# EAGLE design CAN-D Helper Rev1 (EAGLE 9.3.1)
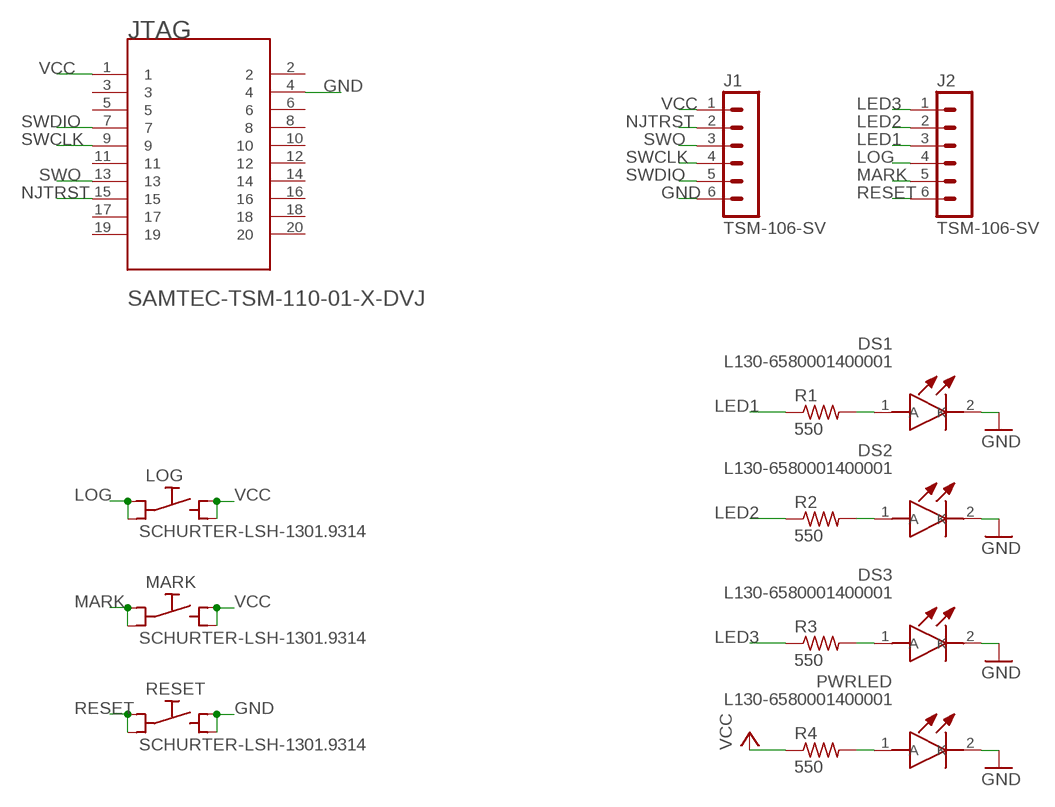
[diagram p0: schematic, sheet 1]

## Parts
DS1  L130-6580001400001  [L130-6580001400001]
DS2  L130-6580001400001  [L130-6580001400001]
DS3  L130-6580001400001  [L130-6580001400001]
J1  TSM-106-SV  [TSM-106-SV]
J2  TSM-106-SV  [TSM-106-SV]
JTAG  SAMTEC-TSM-110-01-X-DVJ  [SAMTEC-TSM-110-01-X-DV]
LOG  SCHURTER-LSH-1301.9314  [LSH]
MARK  SCHURTER-LSH-1301.9314  [LSH]
PWRLED  L130-6580001400001  [L130-6580001400001]
R1  550  R-US_R0603  [R0603]
R2  550  R-US_R0603  [R0603]
R3  550  R-US_R0603  [R0603]
R4  550  R-US_R0603  [R0603]
RESET  SCHURTER-LSH-1301.9314  [LSH]

## Nets
GND: DS1.2(K) DS2.2(K) DS3.2(K) J1.6 JTAG.4 PWRLED.2(K) RESET.NO1(NO) RESET.NO2(NO)
LED1: J2.3 R1.1
LED2: J2.2 R2.1
LED3: J2.1 R3.1
LOG: J2.4 LOG.C1(C) LOG.C2(C)
MARK: J2.5 MARK.C1(C) MARK.C2(C)
N$7: DS1.1(A) R1.2
N$8: DS2.1(A) R2.2
N$9: DS3.1(A) R3.2
N$10: PWRLED.1(A) R4.2
NJTRST: J1.2 JTAG.15
RESET: J2.6 RESET.C1(C) RESET.C2(C)
SWCLK: J1.4 JTAG.9
SWDIO: J1.5 JTAG.7
SWO: J1.3 JTAG.13
VCC: J1.1 JTAG.1 LOG.NO1(NO) LOG.NO2(NO) MARK.NO1(NO) MARK.NO2(NO) R4.1
Unconnected: JTAG.2 JTAG.3 JTAG.5 JTAG.6 JTAG.8 JTAG.10 JTAG.11 JTAG.12 JTAG.14 JTAG.16 JTAG.17 JTAG.18 JTAG.19 JTAG.20

## Library data of the parts
DS1-DS3 PWRLED = L130-6580001400001:L130-6580001400001: Lumileds L130-6580001400001, LUXEON 3014 Series White LED, 6500K, 3014, Rectangle Lens SMD Package Source: Datasheet <http://www.lumileds.com/uploads/459/DS208-pdf>; ALLIED_NUMBER: 70522463; ALLIED_PRICE-STOCK: http://www.alliedelec.com/lumileds-l130-6580001400001/70522463/; DESCRIPTION: Lumileds L130-6580001400001, LUXEON 3014 Series White LED, 6500K, 3014, Rectangle Lens SMD Package; HEIGHT: mm; MANUFACTURER_NAME: Lumileds; MANUFACTURER_PART_NUMBER: L130-6580001400001; MOUSER_PART_NUMBER: 997-L130-65800014001; MOUSER_PRICE-STOCK: https://www.mouser.com/Search/Refine.aspx?Keyword=997-L130-65800014001; RS_PART_NUMBER: 1709867; RS_PRICE-STOCK: http://uk.rs-online.com/web/p/products/1709867
J1 J2 = con-samtec:TSM-106-SV: SMD PIN HEADER
JTAG = SAMTEC-TSM-110-01-X-DV:SAMTEC-TSM-110-01-X-DV; DESCRIPTION: Conn Unshrouded Header HDR 20 POS 2.54mm Solder ST SMD T/R; DIGI-KEY_PART_NUMBER: SAM14887CT-ND; DIGI-KEY_PURCHASE_URL: https://www.digikey.ca/product-detail/en/samtec-inc/TSM-110-01-T-DV-TR/SAM14887CT-ND/9595179?utm_source=snapeda&utm_medium=aggregator&utm_campaign=symbol; MF: Samtec Inc.; MP: TSM-110-01-T-DV-TR; PACKAGE: None
LOG MARK RESET = schurter_switches_LSH_SMS:SCHURTER-LSH-*: Schurter LSH Printmount Switches, Gullwing Leads Momentary Action: Normally Open (NO) 6.0 x 6.0 mm Body Dim. Actuator Diam. mm / Overall Height mm / Schurter # -------------------------------------------------------------- 3.40 / 4.30 / 1301.9314.xx 3.40 / 4.30 / 1301.9315.xx 3.20 / 7.00 / 1301.9316.xx 3.30 / 7.30 / 1301.9317.xx 3.10 / 8.00 / 1301.9319.xx 3.00 / 12.5 / 1301.9320.xx xx: denotes packaging, see Schurter data sheets Author: Dipl.-Ing. FH Rainer Bayer Hochschule Heilbronn HHN: rainer.bayer@hs-heilbronn.de | http://mitarbeiter.hs-heilbronn.de/~rbayer/ Ingenieurbüro ing-rb: mail@ing-rb.de | http://www.ing-rb.de/
R1-R4 = rcl:R-US_: RESISTOR, American symbol; SPICEPREFIX: R

## Board
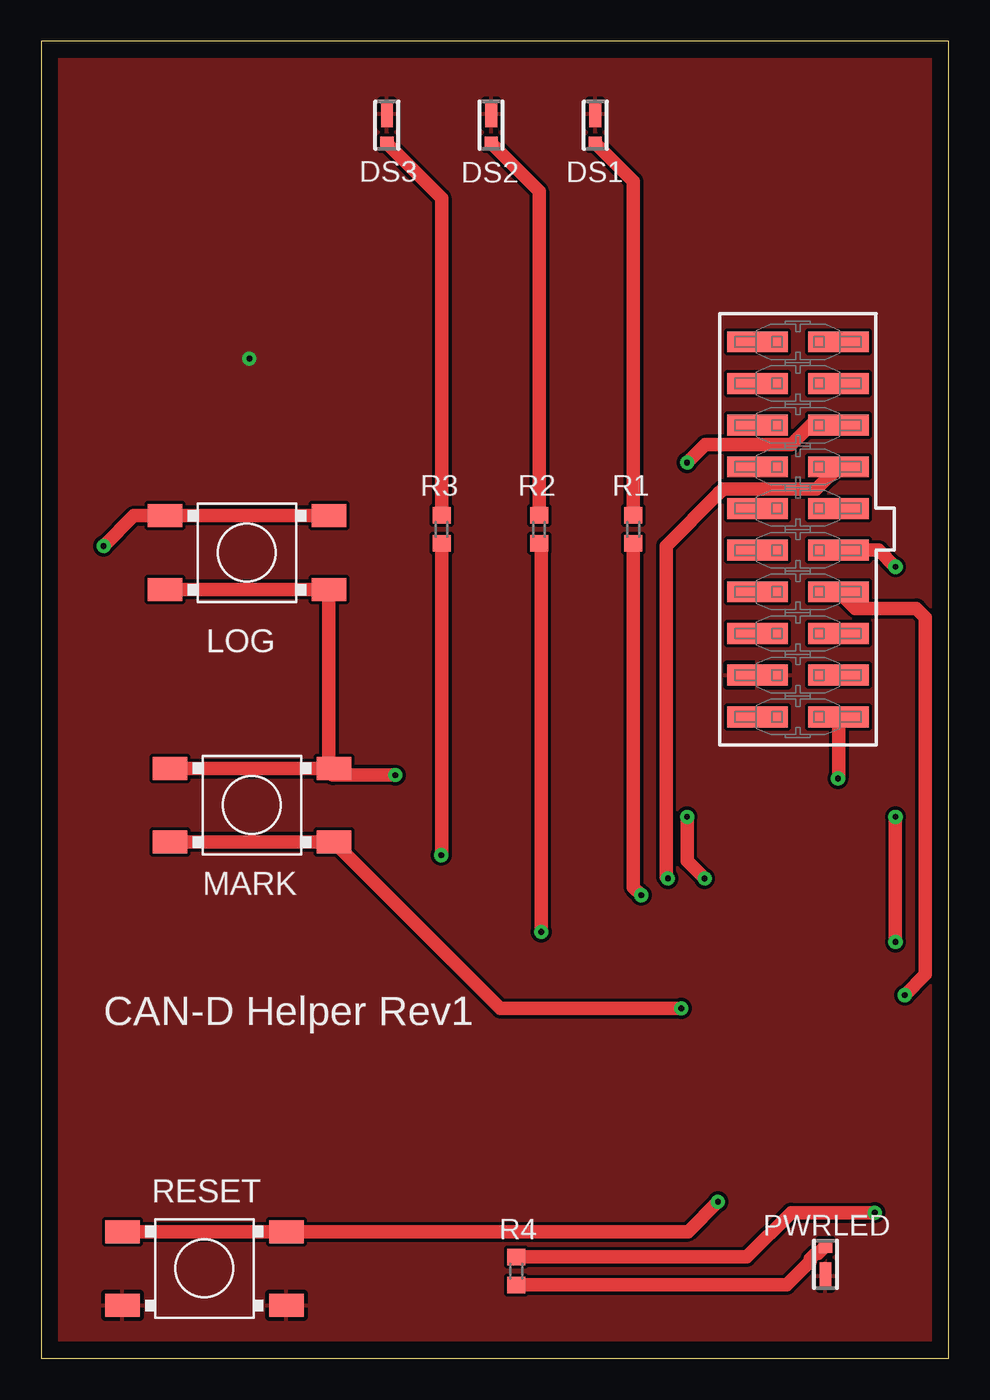
[diagram p1: board, top side]
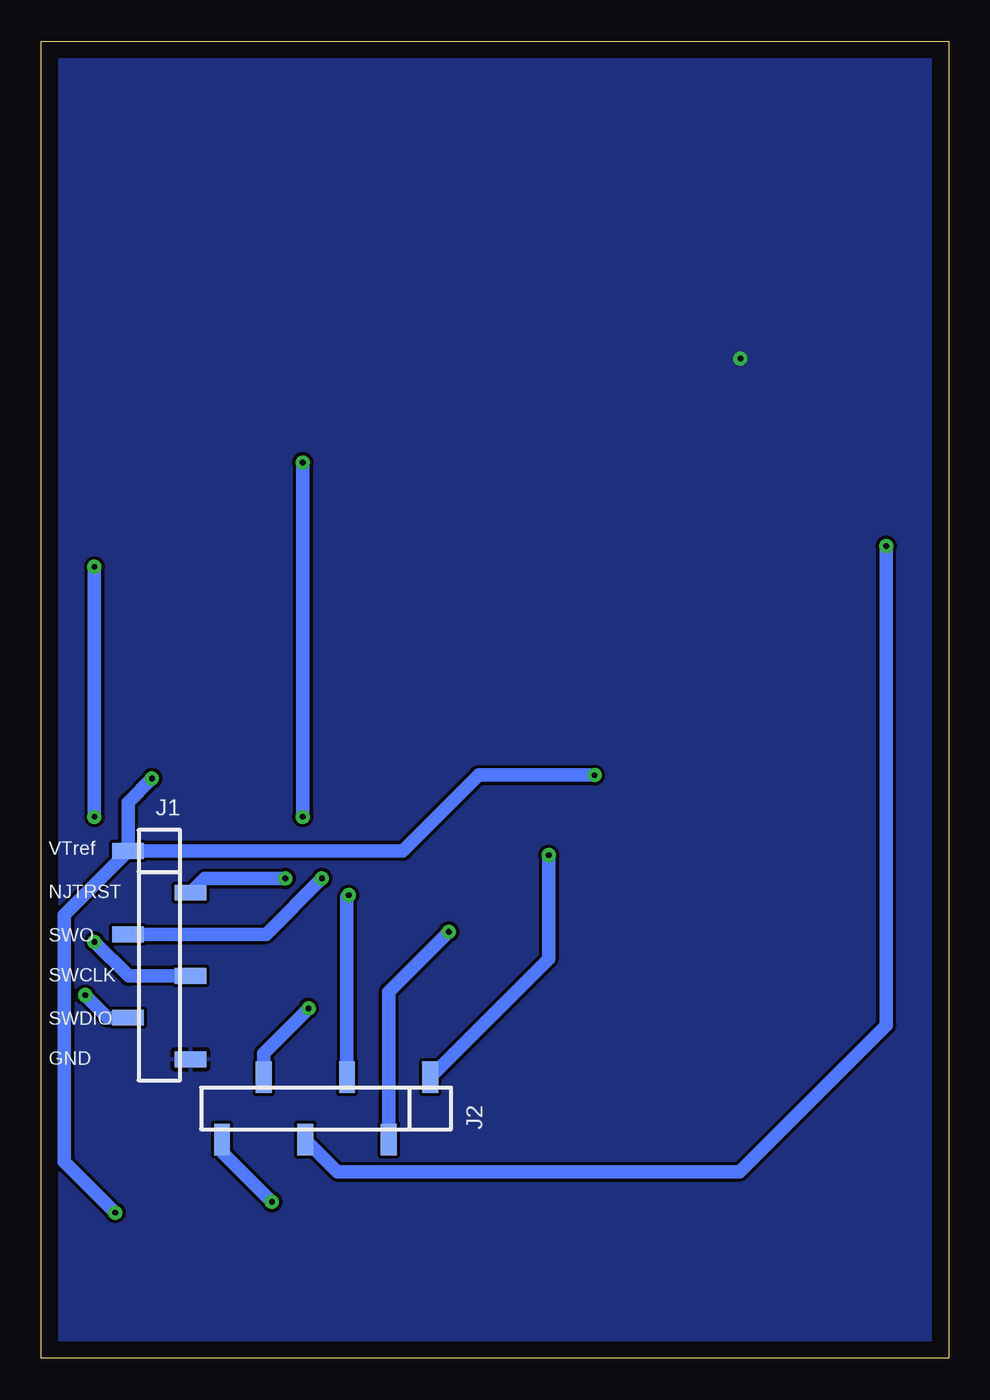
[diagram p2: board, bottom side, seen from below]

Size 55.32 x 80.31 mm. Coordinates in mm from the lower left corner, seen from the top.
Outline: 0,0 55.32,0 55.32,80.31 0,80.31 0,0
Copper layers (1*16): Top 0.035mm / dielectric 1.5mm / Bottom 0.035mm
Design rules "mine": minimum track width 11mil, minimum drill 0.3mm, track to track 8mil, track to pad 6mil, pad to pad 6mil, via to via 6mil, smd to smd 6mil, copper to edge 40mil, drill to drill 6mil, minimum pad ring 12mil, minimum via ring 10mil, stop-mask expansion 4mil, vias tented up to drill 15mil, thermal gap 10mil

### Footprints (pad centres in the part's own frame; a part is rotated, then mirrored left to right if it is on the bottom)
L130-6580001400001 = smd 0.8 x 0.8: 1 -1.11,0 | smd 1.61 x 0.72: 2 0.695,0
TSM-106-SV = smd 0.965 x 1.93: 1 6.35,1.905; 2 3.81,-1.905; 3 1.27,1.905; 4 -1.27,-1.905; 5 -3.81,1.905; 6 -6.35,-1.905
SAMTEC-TSM-110-01-X-DV = smd 1.27 x 3.68: 1 -11.43,-2.476; 2 -11.43,2.476; 3 -8.89,-2.476; 4 -8.89,2.476; 5 -6.35,-2.476; 6 -6.35,2.476; 7 -3.81,-2.476; 8 -3.81,2.476; 9 -1.27,-2.476; 10 -1.27,2.476; 11 1.27,-2.476; 12 1.27,2.476; 13 3.81,-2.476; 14 3.81,2.476; 15 6.35,-2.476; 16 6.35,2.476; 17 8.89,-2.476; 18 8.89,2.476; 19 11.43,-2.476; 20 11.43,2.476
LSH = smd 2.1 x 1.4: C1 -5,-2.25; C2 5,-2.25; NO1 -5,2.25; NO2 5,2.25
R0603 = smd 1 x 1.1: 1 -0.85,0; 2 0.85,0

### Placement (x,y rotation side)
DS1  33.78,75.18 90 top
DS2  27.43,75.18 90 top
DS3  21.08,75.18 90 top
J1  48.11,24.59 90 bottom
J2  37.95,15.24 0 bottom
JTAG  46.13,50.55 90 top
LOG  12.55,49.12 180 top
MARK  12.85,33.73 0 top
PWRLED  47.8,5.74 270 top
R1  36.09,50.55 90 top
R2  30.35,50.55 90 top
R3  24.41,50.55 90 top
R4  28.96,5.33 270 top
RESET  9.96,5.49 180 top

### Tracks (layer width: path | path; a pad name or v marks a point on that pad's centre or on a via)
GND  (via drill 0.35)
  other vias: 12.7,60.96
  pour Top: -2.54,82.55 58.42,82.55 58.42,-2.54 -2.54,-2.54
  pour Bottom: -2.54,82.55 58.42,82.55 58.42,-2.54 -2.54,-2.54
LED1  (via drill 0.35)
  Top 0.813: R1.1 36.09,28.73 v36.58,28.25
  Bottom 0.813: v36.58,28.25 36.68,28.14 J2.3
LED2  (via drill 0.35)
  Top 0.813: R2.1 30.48,49.57 v30.48,26.01
  Bottom 0.813: J2.2 34.14,22.35 v30.48,26.01
LED3  (via drill 0.35)
  Top 0.813: R3.1 24.41,30.71 v24.38,30.68
  Bottom 0.813: v24.38,30.68 24.38,24.36 J2.1
LOG  (via drill 0.35)
  Top 0.813: LOG.C1 LOG.C2 5.65,51.37 v3.81,49.53
  Bottom 0.813: v3.81,49.53 3.81,20.32 12.75,11.38 37.26,11.38 J2.4
MARK  (via drill 0.35)
  Top 0.813: MARK.C1 MARK.C2 28,21.34 v39.01,21.34
  Bottom 0.813: v39.01,21.34 41.76,18.59 J2.5
N$7
  Top 0.813: DS1.1 36.09,71.76 R1.2
N$8
  Top 0.813: DS2.1 30.35,71.15 R2.2
N$9
  Top 0.813: DS3.1 24.41,70.75 R3.2
N$10
  Top 0.813: R4.2 45.44,4.48 46.88,5.93 46.88,6.08 47.21,6.41 47.36,6.41 PWRLED.1
NJTRST  (via drill 0.35)
  Top 0.813: JTAG.15 46.92,56.9 45.72,55.7 40.46,55.7 v39.37,54.61 | v40.44,29.26 39.37,30.33 v39.37,33.02
  Bottom 0.813: v39.37,54.61 v39.37,33.02 | J1.2 45.34,29.26 v40.44,29.26
RESET  (via drill 0.35)
  Top 0.813: RESET.C2 RESET.C1 39.44,7.74 v41.25,9.55
  Bottom 0.813: v41.25,9.55 44.3,12.6 J2.6
SWCLK  (via drill 0.35)
  Top 0.813: JTAG.9 51.05,49.28 v52.07,48.26 | v52.07,33.02 v52.07,25.4
  Bottom 0.813: v52.07,48.26 v52.07,33.02 | J1.4 49.99,23.32 v52.07,25.4
SWDIO  (via drill 0.35)
  Top 0.813: JTAG.7 49.62,45.72 53.34,45.72 53.9,45.16 53.9,23.42 v52.63,22.15
  Bottom 0.813: J1.5 51.26,20.78 v52.63,22.15
SWO  (via drill 0.35)
  Top 0.813: JTAG.13 47.26,53.01 41.58,53.01 41.25,52.68 | 41.25,52.68 | 41.25,52.68 38.1,49.53 38.1,29.36 v38.2,29.26
  Bottom 0.813: J1.3 41.6,25.86 v38.2,29.26
VCC  (via drill 0.35)
  Top 0.813: LOG.NO2 LOG.NO1 17.55,36.29 MARK.NO2 | R4.1 43.01,6.18 45.71,8.89 v50.8,8.89 | MARK.NO1 MARK.NO2 | v21.59,35.56 17.78,35.56 17.85,35.63 MARK.NO2 | JTAG.1 48.6,35.39 v48.56,35.36
  Bottom 0.813: v50.8,8.89 53.9,11.99 53.9,27.05 J1.1 | v21.59,35.56 28.65,35.56 33.28,30.94 J1.1 | J1.1 50.01,33.91 v48.56,35.36

### Text on the board
tPlace: CAN-D Helper Rev1
bNames: VTref | NJTRST | SWO | SWCLK | SWDIO | GND